# Altium project ASSIGNMENTS.PrjPcb
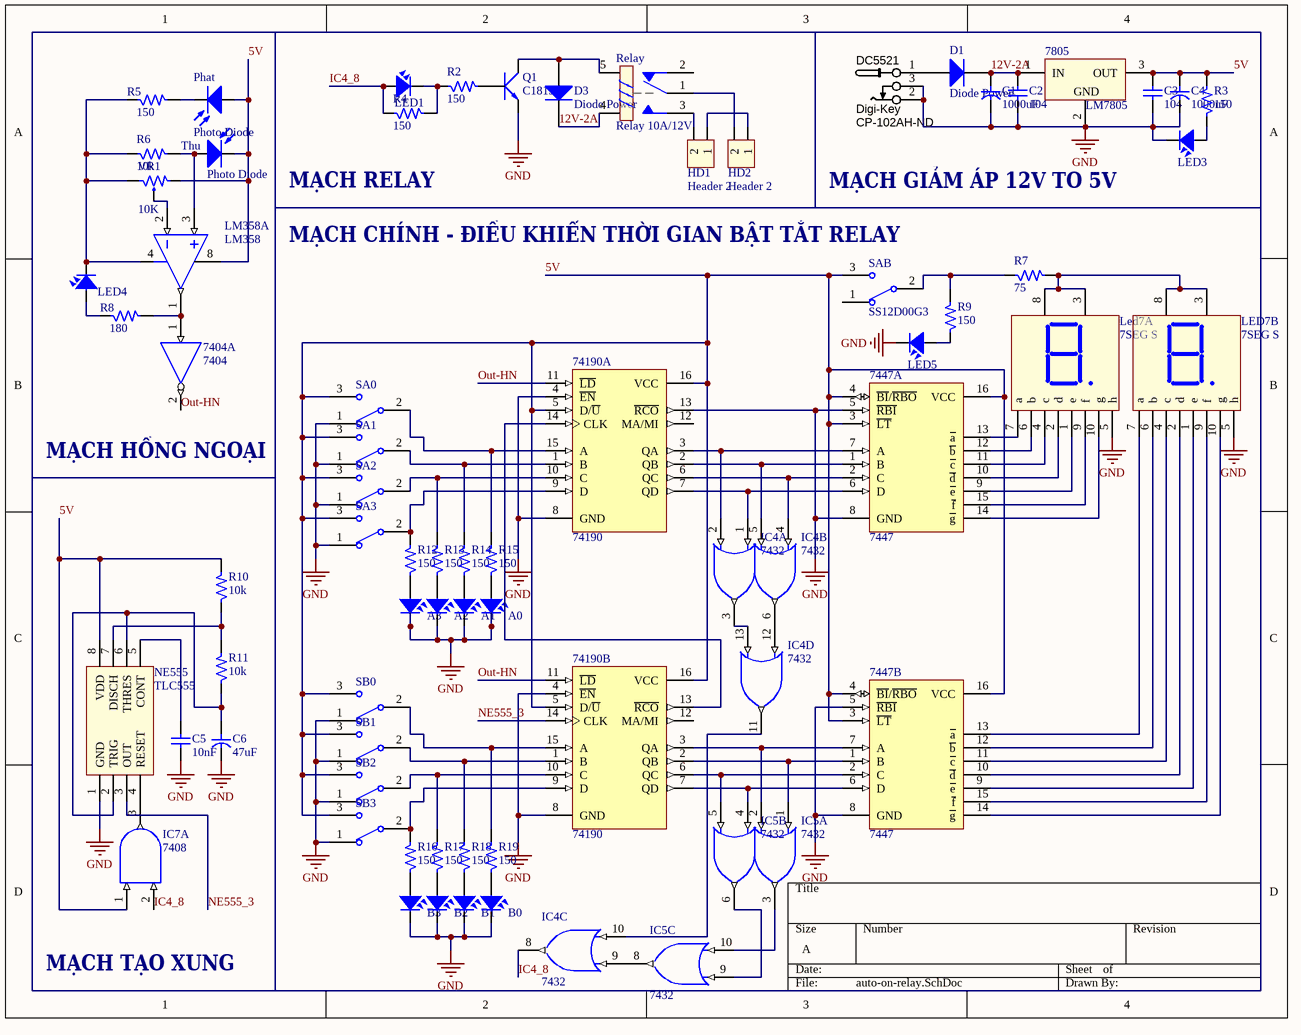
[diagram p0: auto-on-relay.SchDoc]
1 sheet, 68 parts. Net scope: global (net labels, ports and power ports of the same name join across sheets).
Board files: auto-on-relay.PcbDoc, mach-in.PcbDoc

## Sheet auto-on-relay.SchDoc
size A; SheetNumber: 1; SheetTotal: 1

### Parts
7404  7404  [DIP14/W0.3]  (part A of 6)
7447A  7447  [DIP16/W0.3]
7447B  7447  [DIP16/W0.3]
7805  LM7805  [QTO-220]
74190A  74190  [DIP16/W0.3]
74190B  74190  [DIP16/W0.3]
A0  LED  [LED-3]  (value not drawn)
A1  LED  [LED-3]  (value not drawn)
A2  LED  [LED-3]  (value not drawn)
A3  LED  [LED-3]  (value not drawn)
B0  LED  [LED-3]  (value not drawn)
B1  LED  [LED-3]  (value not drawn)
B2  LED  [LED-3]  (value not drawn)
B3  LED  [LED-3]  (value not drawn)
C1  1000uF  [CYL/D.400/LS.200]
C2  104  [CAP Ceramic/W300]
C3  104  [CAP Ceramic/W300]
C4  1000uF  [CYL/D.400/LS.200]
C5  10nF  [CAP Ceramic/W300]
C6  47uF  [CYL/D.400/LS.200]
D1  Diode Power  [DIODE/POW/1A]
D3  Diode Power  [DIODE/POW/1A]
DC5521  Supplier 1: Digi-Key  Supplier Part Number 1: CP-102AH-ND  [CONN_PWR_JACK_2.1x5.5mm]  (hidden comment: CONN_PWR_JACK_2.1x5.5mm)
HD1  Header 2  [HED2]
HD2  Header 2  [HED2]
IC4  7432  [DIP14/W0.3]  (parts A,B,C,D of 4)
IC5  7432  [DIP14/W0.3]  (parts A,B,C of 4)
IC7  7408  [DIP14/W0.3]  (part A of 4)
LED1  LED  [LED-5-RED]  (value not drawn)
LED3  LED  [LED-3]  (value not drawn)
LED4  LED  [LED-3]  (value not drawn)
LED5  LED  [LED-3]  (value not drawn)
Led7A  7SEG S  [7SEGS]
LED7B  7SEG S  [7SEGS]
LM358  LM358  [DIP8/W0.3]  (part A of 2)
NE555  TLC555  [DIP 8]
Phat  Photo Diode  [LED-5-GREEN]
Q1  C1815  [QTO-92]
R2  150  [R1/4W]
R3  150  [R1/4W]
R4  150  [R1/4W]
R5  150  [R1/4W]
R6  10k  [R1/4W]
R7  75  [R1/4W]
R8  180  [R1/4W]
R9  150  [R1/4W]
R10  10k  [R1/4W]
R11  10k  [R1/4W]
R12  150  [R1/4W]
R13  150  [R1/4W]
R14  150  [R1/4W]
R15  150  [R1/4W]
R16  150  [R1/4W]
R17  150  [R1/4W]
R18  150  [R1/4W]
R19  150  [R1/4W]
Relay  Relay 10A/12V  [RL_SPDT_10A]
SA0  SS12D00G3  [SS12D00G3]  (value not drawn)
SA1  SS12D00G3  [SS12D00G3]  (value not drawn)
SA2  SS12D00G3  [SS12D00G3]  (value not drawn)
SA3  SS12D00G3  [SS12D00G3]  (value not drawn)
SAB  SS12D00G3  [SS12D00G3]
SB0  SS12D00G3  [SS12D00G3]  (value not drawn)
SB1  SS12D00G3  [SS12D00G3]  (value not drawn)
SB2  SS12D00G3  [SS12D00G3]  (value not drawn)
SB3  SS12D00G3  [SS12D00G3]  (value not drawn)
Thu  Photo Diode  [LED-5-GREEN]
VR1  10K  [VR]

### Nets
GND: 7404.7(GND) 7447A.5(~{RBI}) 7447A.8(GND) 7447B.5(~{RBI}) 7447B.8(GND) 7805.2(GND) 74190A.4(~{EN}) 74190A.8(GND) 74190A.13(~{RCO}) 74190B.4(~{EN}) 74190B.8(GND) A0.2 A1.2 A2.2 A3.2 B0.2 B1.2 B2.2 B3.2 C1.2 C2.2 C3.2 C4.2 C5.2 C6.2 DC5521.2 DC5521.3 IC4.7(GND) IC5.7(GND) IC7.7(GND) LED3.2 LED5.2 Led7A.5(h) LED7B.5(h) NE555.1(GND) Q1.1(E) SA0.1 SA1.1 SA2.1 SA3.1 SB0.1 SB1.1 SB2.1 SB3.1
VCC: 7404.14(VCC) IC4.14(VCC) IC5.14(VCC) IC7.14(VCC)
5V: 7447A.3(~{LT}) 7447A.4(~{BI}/~{RBO}) 7447A.16(VCC) 7447B.3(~{LT}) 7447B.4(~{BI}/~{RBO}) 7447B.16(VCC) 7805.3(OUT) 74190A.5(D/~{U}) 74190A.16(VCC) 74190B.5(D/~{U}) 74190B.16(VCC) C3.1 C4.1 IC7.1(A) LM358.8(+V) NE555.8(VDD) Phat.1(A) R3.2 R10.2 SA0.3 SA1.3 SA2.3 SA3.3 SAB.3 SB0.3 SB1.3 SB2.3 SB3.3 Thu.2(K) VR1.1
12V-2A: 7805.1(IN) C1.1 C2.1 D1.2(K) D3.2(K) Relay.4
IC4_8: IC4.8(Y) IC7.2(B) LED1.1 R4.1
NE555_3: 74190B.14(CLK) NE555.3(OUT)
Out-HN: 7404.2(~{O}) 74190A.11(~{LD}) 74190B.11(~{LD})
Net7404_1: 7404.1(A) LM358.1(OUT) R8.2
Net7447A_1: 7447A.1(B) 74190A.2(QB) IC4.5(B)
Net7447A_2: 7447A.2(C) 74190A.6(QC) IC4.4(A)
Net7447A_6: 7447A.6(D) 74190A.7(QD) IC4.1(A)
Net7447A_7: 7447A.7(A) 74190A.3(QA) IC4.2(B)
Net7447A_9: 7447A.9(~{e}) Led7A.1(e)
Net7447A_10: 7447A.10(~{d}) Led7A.2(d)
Net7447A_11: 7447A.11(~{c}) Led7A.4(c)
Net7447A_12: 7447A.12(~{b}) Led7A.6(b)
Net7447A_13: 7447A.13(~{a}) Led7A.7(a)
Net7447A_14: 7447A.14(~{g}) Led7A.10(g)
Net7447A_15: 7447A.15(~{f}) Led7A.9(f)
Net7447B_1: 7447B.1(B) 74190B.2(QB) IC5.1(A)
Net7447B_2: 7447B.2(C) 74190B.6(QC) IC5.5(B)
Net7447B_6: 7447B.6(D) 74190B.7(QD) IC5.4(A)
Net7447B_7: 7447B.7(A) 74190B.3(QA) IC5.2(B)
Net7447B_9: 7447B.9(~{e}) LED7B.1(e)
Net7447B_10: 7447B.10(~{d}) LED7B.2(d)
Net7447B_11: 7447B.11(~{c}) LED7B.4(c)
Net7447B_12: 7447B.12(~{b}) LED7B.6(b)
Net7447B_13: 7447B.13(~{a}) LED7B.7(a)
Net7447B_14: 7447B.14(~{g}) LED7B.10(g)
Net7447B_15: 7447B.15(~{f}) LED7B.9(f)
Net74190A_1: 74190A.1(B) R14.2 SA1.2
Net74190A_9: 74190A.9(D) R12.2 SA3.2
Net74190A_10: 74190A.10(C) R13.2 SA2.2
Net74190A_14: 74190A.14(CLK) 74190B.13(~{RCO})
Net74190A_15: 74190A.15(A) R15.2 SA0.2
Net74190B_1: 74190B.1(B) R18.2 SB1.2
Net74190B_9: 74190B.9(D) R16.2 SB3.2
Net74190B_10: 74190B.10(C) R17.2 SB2.2
Net74190B_15: 74190B.15(A) R19.2 SB0.2
NetA0_1: A0.1 R15.1
NetA1_1: A1.1 R14.1
NetA2_1: A2.1 R13.1
NetA3_1: A3.1 R12.1
NetB0_1: B0.1 R19.1
NetB1_1: B1.1 R18.1
NetB2_1: B2.1 R17.1
NetB3_1: B3.1 R16.1
NetC5_1: C5.1 NE555.5(CONT)
NetC6_1: C6.1 NE555.2(TRIG) NE555.6(THRES) R11.1
NetD1_1: D1.1(A) DC5521.1
NetD3_1: D3.1(A) Q1.2(C) Relay.5
NetHD1_1: HD1.1 HD2.1
NetHD1_2: HD1.2 Relay.3
NetHD2_2: HD2.2 Relay.1
NetIC4_3: IC4.3(Y) IC4.13(B)
NetIC4_6: IC4.6(Y) IC4.12(A)
NetIC4_9: IC4.9(A) IC5.8(Y)
NetIC4_10: IC4.10(B) IC4.11(Y)
NetIC5_3: IC5.3(Y) IC5.10(B)
NetIC5_6: IC5.6(Y) IC5.9(A)
NetIC7_3: IC7.3(O) NE555.4(RESET)
NetLED1_2: LED1.2 R2.1 R4.2
NetLED3_1: LED3.1 R3.1
NetLED4_1: LED4.1 R8.1
NetLED4_2: LED4.2 LM358.4(-V) R5.1 R6.1 VR1.3
NetLED5_1: LED5.1 R9.1
NetLed7A_3: Led7A.3(Vcc) Led7A.8(Vcc) LED7B.3(Vcc) LED7B.8(Vcc) R7.2
NetLM358_2: LM358.2(IN-) VR1.2
NetLM358_3: LM358.3(IN+) R6.2 Thu.1(A)
NetNE555_7: NE555.7(DISCH) R10.1 R11.2
NetPhat_2: Phat.2(K) R5.2
NetQ1_3: Q1.3(B) R2.2
NetR7_1: R7.1 R9.2 SAB.2

Not connected (* = marked no-connect by the designer): 74190A 12(MA/MI); 74190B 12(MA/MI); Relay 2; SAB 1

### Notes on the sheet
- MẠCH RELAY
- MẠCH GIẢM ÁP 12V TO 5V
- MẠCH CHÍNH - ĐIỀU KHIỂN THỜI GIAN BẬT TẮT RELAY
- MẠCH HỒNG NGOẠI
- MẠCH TẠO XUNG

### Library data of the parts
7404 = 7404: Hex Inverter; Code_IPC: SOIC127P600-14; ComponentLink1Description: Manufacturer Link; ComponentLink1URL: http://www.national.com/; ComponentLink2Description: Datasheet; ComponentLink2URL: http://www.fairchildsemi.com/ds/74/74F04.pdf; Value: 7404
7447A 7447B = 7447: BCD to 7-Segment Decoder/Driver; Value: 7447 , 74247
7805 = LM78xx: On ap +, from + 5 to + 24VDC; Value: LM7805
74190A 74190B = 74190: Synchronous 4-Bit Up/Down Counter with Mode Control; Value: 74190; Copyright by: VanDungEvn@Gmail.com
A0-A3 B0-B3 LED1 LED3-LED5 = LED: LED Single colour Green and Red; Value: LED 3 ly Single Colour
C1 C4 C6 = Capacitor: Capacitor pol
C2 C3 C5 = Capacitor NP: Capacitor non-pol
DC5521 = CONN_PWR_JACK_2.1x5.5mm: Power Connector, THT, 2.1mm ID, 5.5mm OD; Manufacturer 1: CUI Inc; Manufacturer Part Number 1: PJ-102AH; SCDType: undef; Category: Connectors; Mounting Type: Through Hole; Package / Case: PCB mount; Value: 2.1mm ID, 5.5mm OD
HD1 HD2 = Header 2: Header 2 (Green); Value: Header 2
IC4 IC5 = 7432: Quad 2-Input OR Gate
IC7 = 7408: Quad 2-Input AND Gate; Value: 7408
Led7A LED7B = LED 7S: Single 7 Seg Dipslay; Value: LED 7S SEG
LM358 = LM358: Low-Power Dual Operational Amplifier; Value: LM358
NE555 = TLC555: TLC555 LinCMOS™ Timer
Phat Thu = Photo Diode: Photosensitive Diode
Q1 = C1815: NPN 600mW, ECB; Value: C1815
R2-R19 = Res
Relay = Relay 1: Relay SPDT,10A - 12VDC 5 Pin; Value: Relay SPDT, 10A, 12V
SA0-SA3 SAB SB0-SB3 = SS12D00G3: Switch; Manufacturer_Name: Vimex; Datasheet Link: http://vimex.com/switches/techdocs/SS12D00-tech.pdf; Height: 7mm; Manufacturer_Part_Number: SS12D00G3
VR1 = VR: Var Resistor RM065; RM065-503: 5K; RM065-103: 1K; RM065-104: 10K
D1 D3 = Diode Power: Published: 8-Jun-2000; LatestRevisionDate: 17-Jul-2002; LatestRevisionNote: Re-released for DXP Platform.; DatasheetDocument: 1998; PackageDocument: Aug-1999; PackageReference: DO-201AD; Publisher: Altium Limited; ComponentLink1Description: Manufacturer Link; ComponentLink1URL: http://www.fairchildsemi.com/; ComponentLink2Description: Datasheet; ComponentLink2URL: http://www.fairchildsemi.com/ds/1N%2F1N5400.pdf